# Altium schematic sheet Sensores.SchDoc
size A4
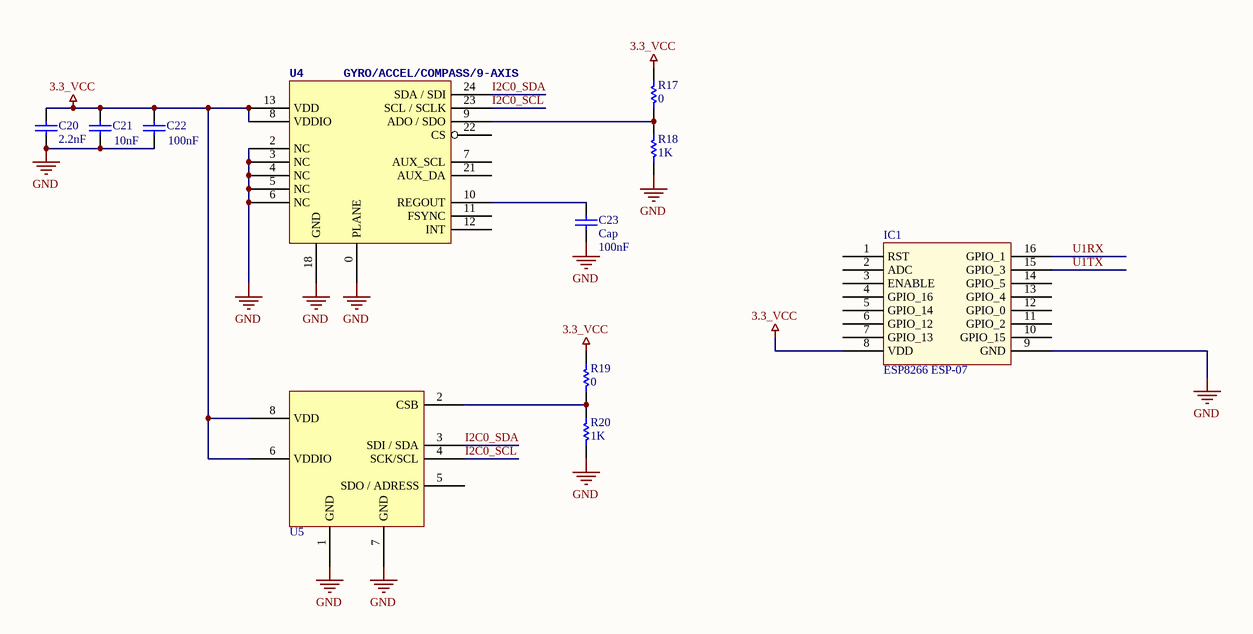
[diagram p0: Sensores.SchDoc]

## Parts
C20  value 2.2nF  [6-0805_L]  (hidden comment: Cap)
C21  value 10nF  [6-0805_L]  (hidden comment: Cap)
C22  value 100nF  [6-0805_L]  (hidden comment: Cap)
C23  Cap  value 100nF  [6-0805_L]
IC1  ESP8266 ESP-07  [ESP8266 ESP-ANTENNA]
R17  value 0  [C0805]  (hidden comment: Res1)
R18  value 1K  [C0805]  (hidden comment: Res1)
R19  value 0  [C0805]  (hidden comment: Res1)
R20  value 1K  [6-0805_L]  (hidden comment: Res1)
U4  GYRO/ACCEL/COMPASS/9-AXIS  [QFN-24/3MM]
U5  BMP280  [LGA-8_BMP280(Primary)]  (value not drawn)

## Nets
3.3_VCC: C20.1 C21.2 C22.2 IC1.8(VDD) R17.2 R19.2 U4.8(VDDIO) U4.13(VDD) U5.6(VDDIO) U5.8(VDD)
GND: C20.2 C21.1 C22.1 C23.1 IC1.9(GND) R18.2 R20.2 U4.0(PLANE) U4.2(NC) U4.3(NC) U4.4(NC) U4.5(NC) U4.6(NC) U4.18(GND) U5.1(GND) U5.7(GND)
I2C0_SCL: U4.23(SCL_/_SCLK) U5.4(SCK/SCL)
I2C0_SDA: U4.24(SDA_/_SDI) U5.3(SDI_/_SDA)
U1RX: IC1.16(GPIO_1)
U1TX: IC1.15(GPIO_3)
NetC23_2: C23.2 U4.10(REGOUT)
NetR17_1: R17.1 R18.1 U4.9(ADO_/_SDO)
NetR19_1: R19.1 R20.1 U5.2(CSB)

Not connected (* = marked no-connect by the designer): IC1 1(RST) 2(ADC) 3(ENABLE) 4(GPIO_16) 5(GPIO_14) 6(GPIO_12) 7(GPIO_13) 10(GPIO_15) 11(GPIO_2) 12(GPIO_0) 13(GPIO_4) 14(GPIO_5); U4 7(AUX_SCL) 11(FSYNC) 12(INT) 21(AUX_DA) 22(CS); U5 5(SDO_/_ADRESS)

## Library data of the parts
C20-C23 = Cap: Capacitor; Published: 8-Jun-2000; LatestRevisionDate: 17-Jul-2002; LatestRevisionNote: Re-released for DXP Platform.; PackageReference: RAD-0.3; Publisher: Altium Limited; PackageDescription: Radial Cap, Thru-Hole; 2 Leads; 0.3 in Pin Spacing
R17-R20 = Res1: Resistor; Published: 8-Jun-2000; LatestRevisionDate: 17-Jul-2002; LatestRevisionNote: Re-released for DXP Platform.; PackageReference: AXIAL-0.3; Publisher: Altium Limited; PackageDescription: Axial Device, Thru-Hole; 2 Leads; 0.3 in Pin Spacing
U4 = MPU-9250
U5 = BMP280: Barometro; Value: *